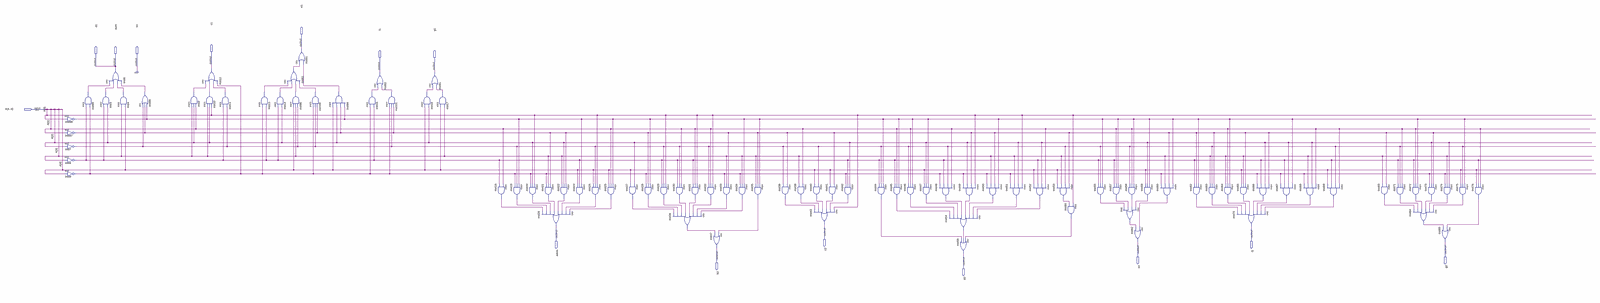
[diagram p0: schematic sheet, whole]
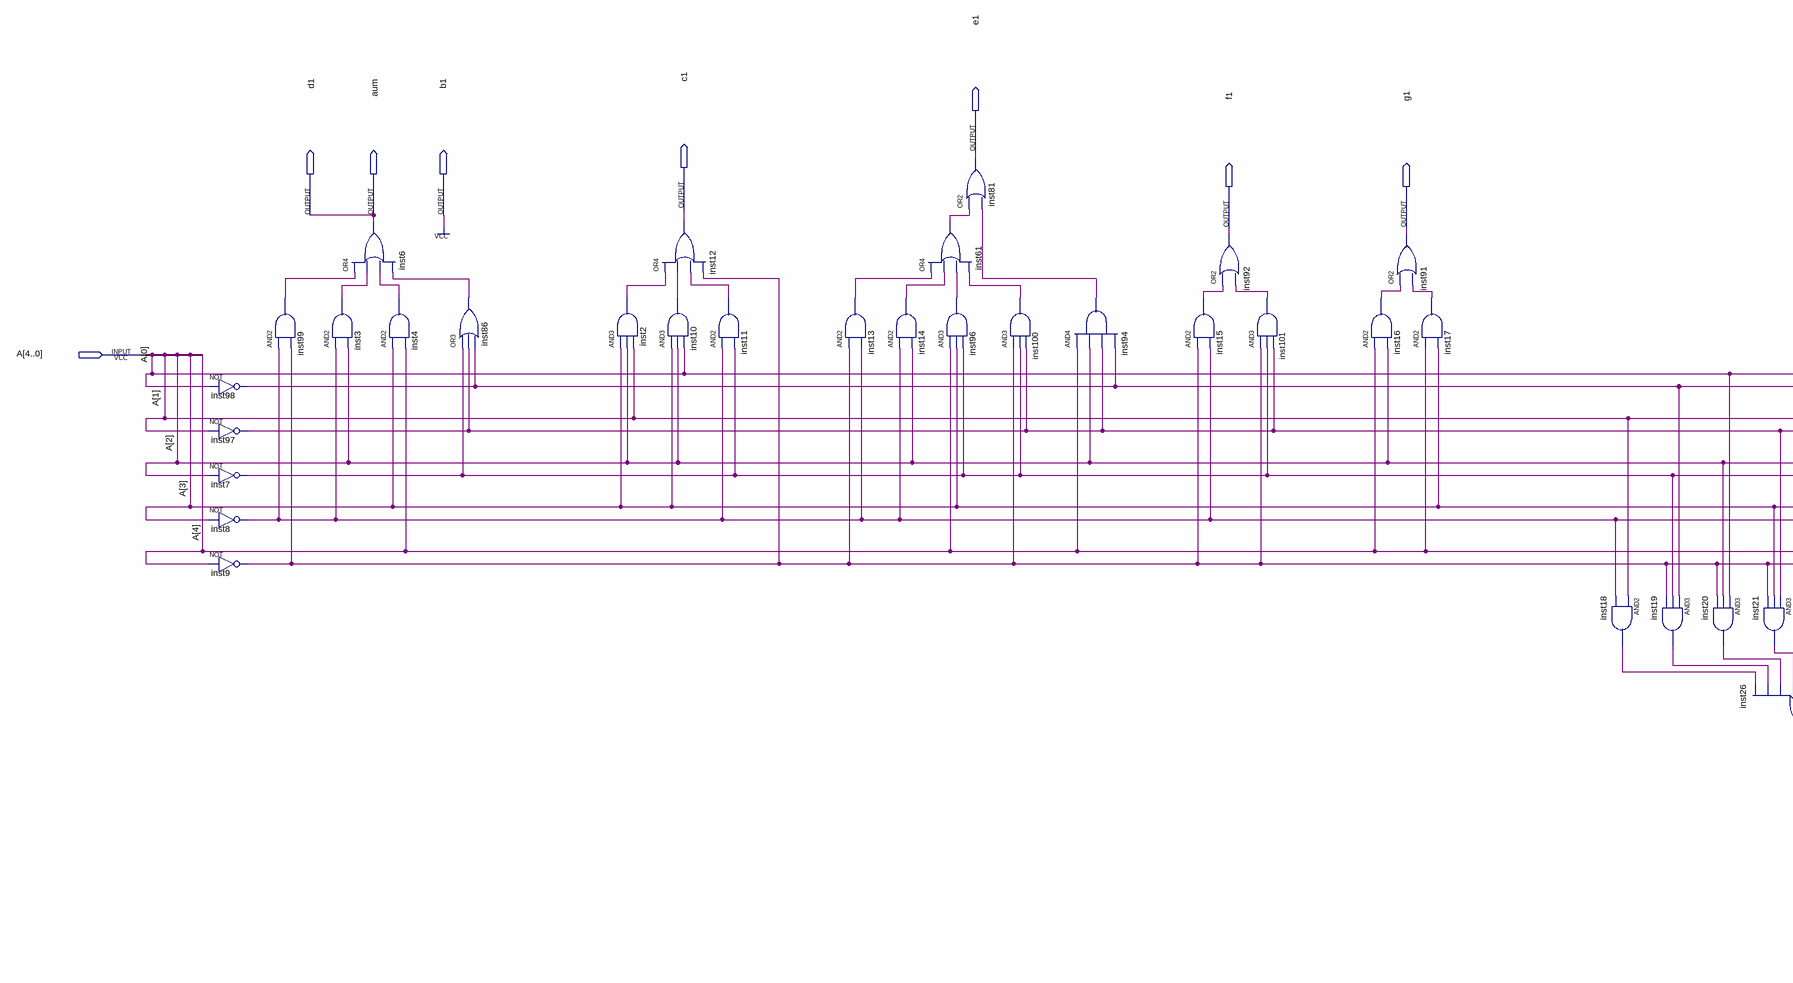
[diagram p1: schematic sheet, left part]
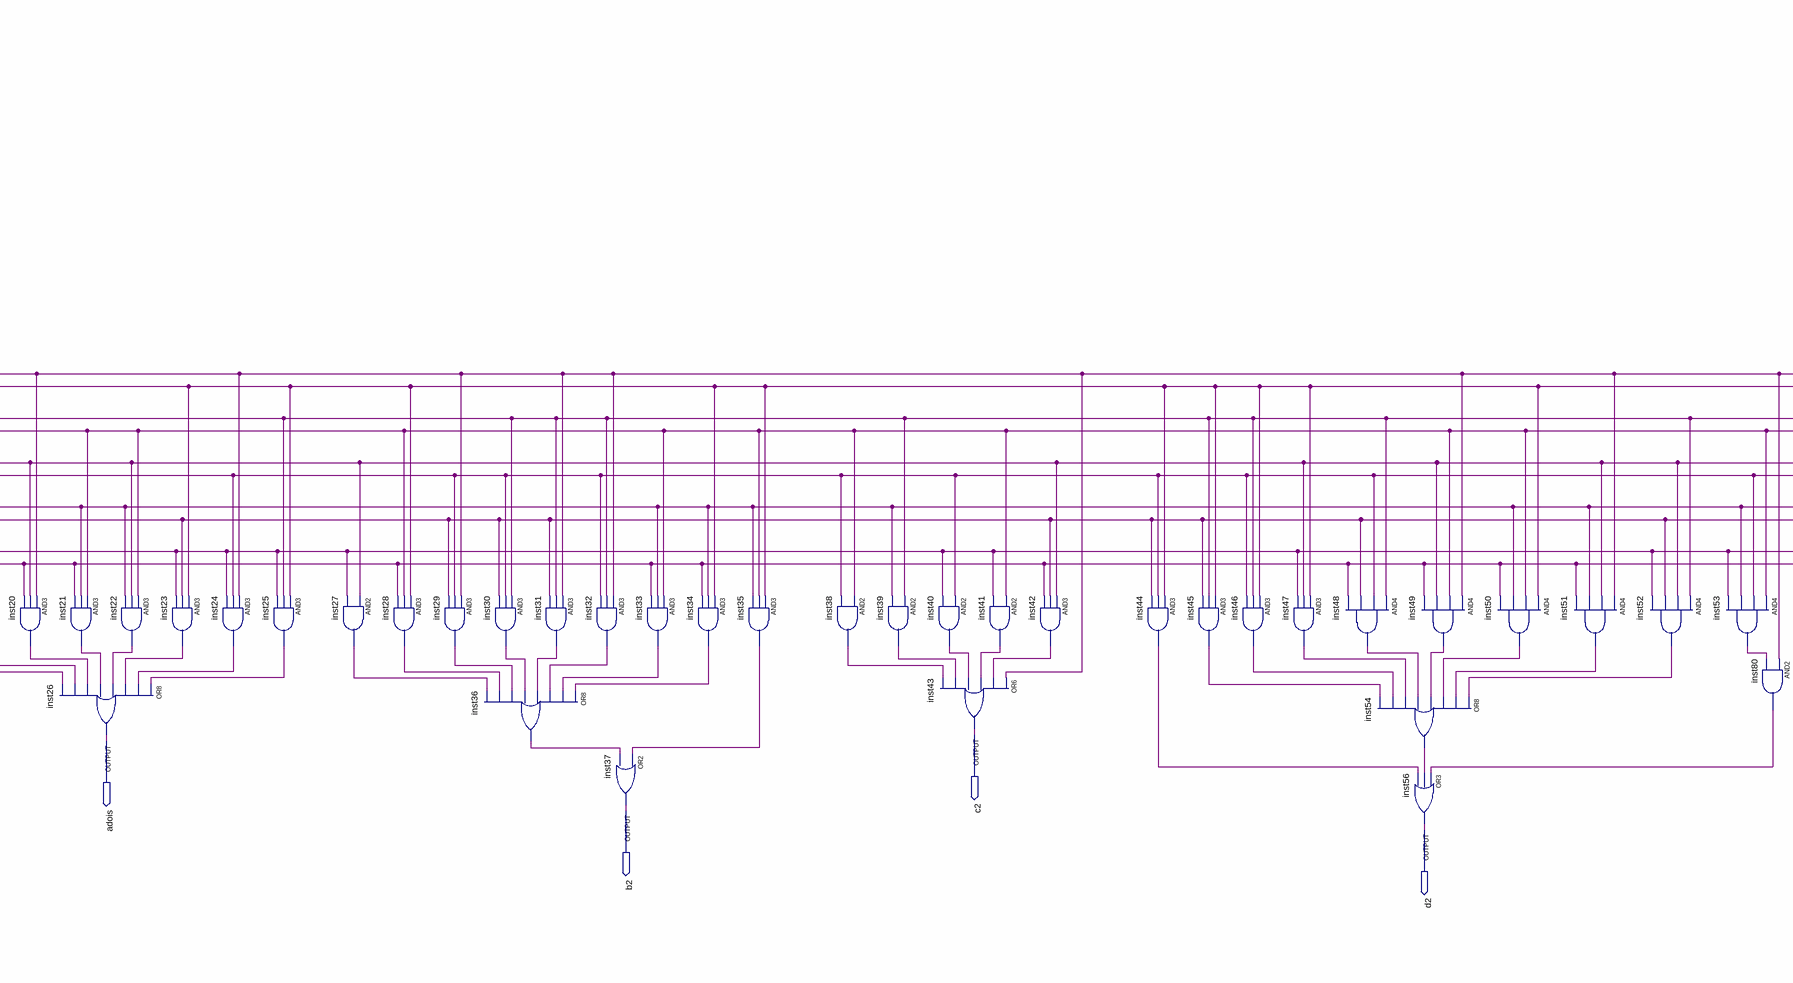
[diagram p2: schematic sheet, centre part]
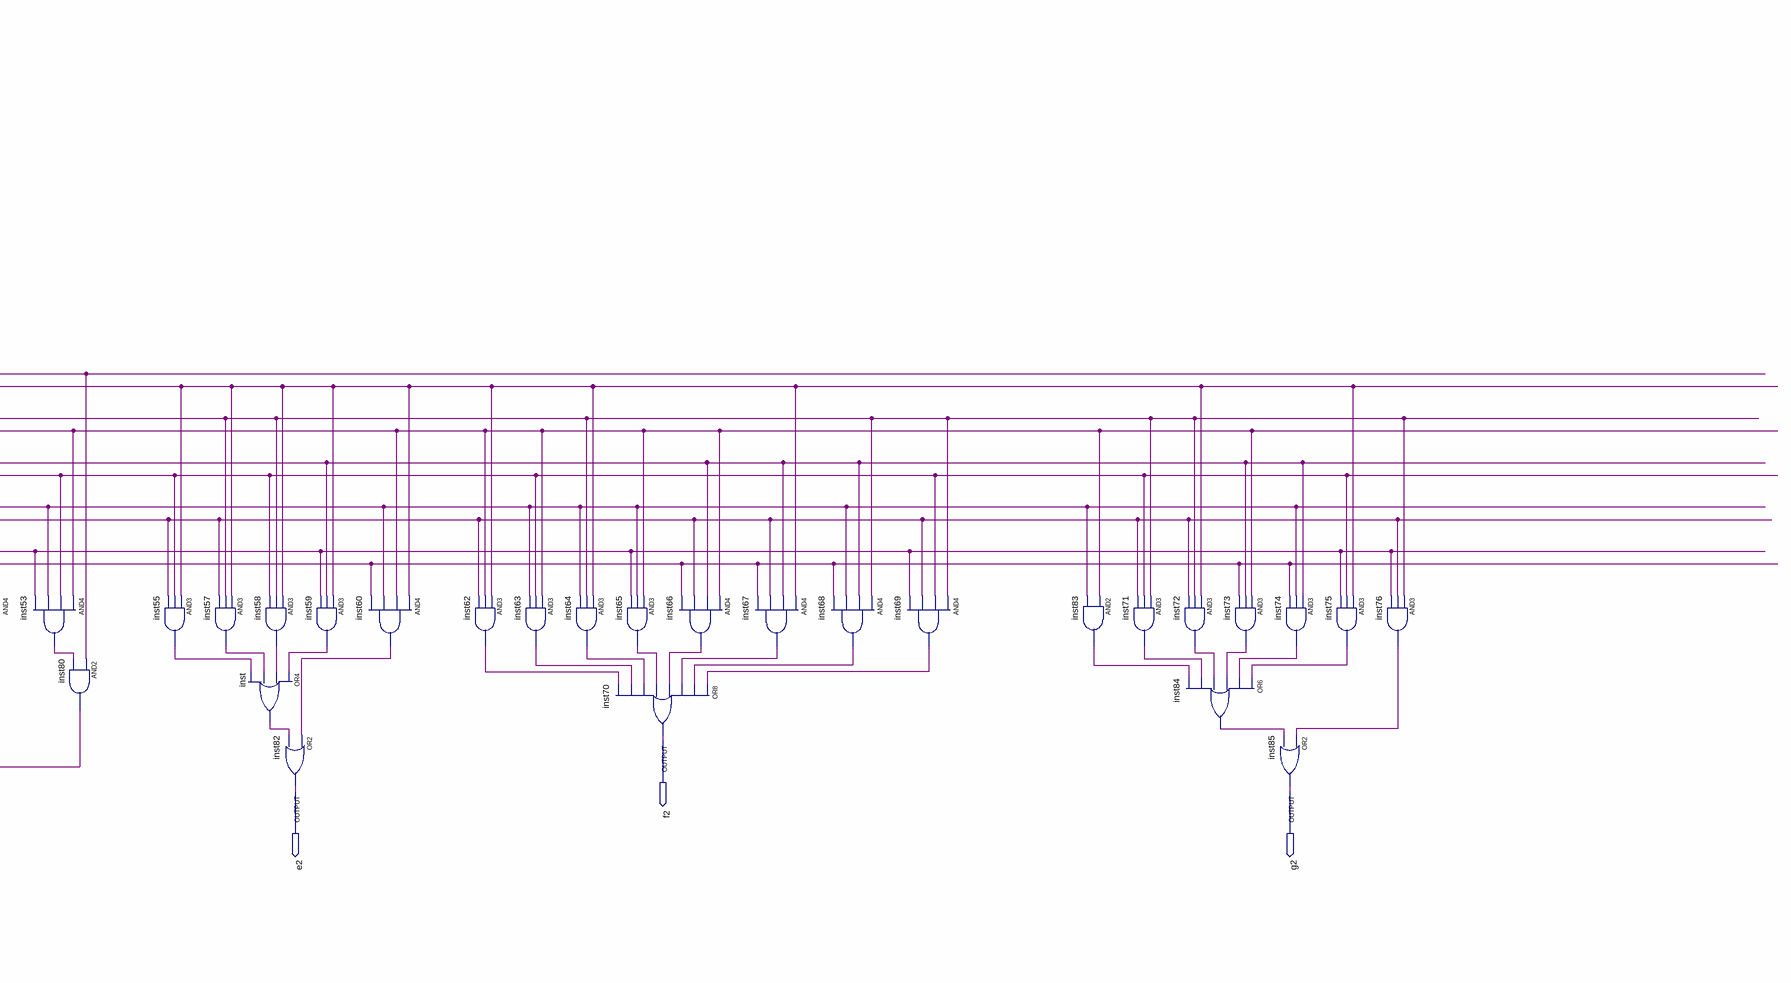
[diagram p3: schematic sheet, right part]
// Quartus schematic 7segmentos_saida.bdf as structural Verilog: 91 symbols, 15 pins
module \7segmentos_saida  (
  input  [4:0] A,
  output e1,
  output c1,
  output d1,
  output aum,
  output b1,
  output f1,
  output g1,
  output c2,
  output adois,
  output f2,
  output e2,
  output g2,
  output b2,
  output d2
);

  wire inst2_out, inst3_out, inst4_out, inst7_out, inst8_out, inst9_out, inst10_out, inst11_out, inst13_out,
       inst14_out, inst15_out, inst16_out, inst17_out, inst18_out, inst19_out, inst20_out, inst21_out,
       inst22_out, inst23_out, inst24_out, inst25_out, inst27_out, inst28_out, inst29_out, inst30_out,
       inst31_out, inst32_out, inst33_out, inst34_out, inst35_out, inst36_out, inst38_out, inst39_out,
       inst40_out, inst41_out, inst42_out, inst44_out, inst45_out, inst46_out, inst47_out, inst48_out,
       inst49_out, inst50_out, inst51_out, inst52_out, inst53_out, inst54_out, inst55_out, inst57_out,
       inst58_out, inst59_out, inst60_out, inst61_out, inst62_out, inst63_out, inst64_out, inst65_out,
       inst66_out, inst67_out, inst68_out, inst69_out, inst71_out, inst72_out, inst73_out, inst74_out,
       inst75_out, inst76_out, inst80_out, inst83_out, inst84_out, inst86_out, inst94_out, inst96_out,
       inst97_out, inst98_out, inst99_out, inst100_out, inst101_out, inst_out;

  not inst98 (inst98_out, A[0]);
  not inst97 (inst97_out, A[1]);
  not inst7 (inst7_out, A[2]);
  not inst8 (inst8_out, A[3]);
  not inst9 (inst9_out, A[4]);
  and inst99 (inst99_out, inst8_out, inst9_out);
  or inst6 (aum, inst99_out, inst3_out, inst4_out, inst86_out);
  and inst3 (inst3_out, inst8_out, A[2]);
  and inst4 (inst4_out, A[3], A[4]);
  or inst86 (inst86_out, inst7_out, inst97_out, inst98_out);
  or inst12 (c1, inst2_out, inst10_out, inst11_out, inst9_out);
  and inst2 (inst2_out, A[3], A[2], A[1]);
  and inst10 (inst10_out, A[3], A[2], A[0]);
  and inst11 (inst11_out, inst8_out, inst7_out);
  and inst13 (inst13_out, inst9_out, inst8_out);
  and inst14 (inst14_out, inst8_out, A[2]);
  or inst81 (e1, inst61_out, inst94_out);
  or inst61 (inst61_out, inst13_out, inst14_out, inst96_out, inst100_out);
  and inst96 (inst96_out, A[4], A[3], inst7_out);
  and inst100 (inst100_out, inst9_out, inst7_out, inst97_out);
  and inst94 (inst94_out, A[4], A[2], inst97_out, inst98_out);
  or inst92 (f1, inst15_out, inst101_out);
  and inst15 (inst15_out, inst9_out, inst8_out);
  and inst101 (inst101_out, inst9_out, inst7_out, inst97_out);
  and inst16 (inst16_out, A[4], A[2]);
  or inst91 (g1, inst16_out, inst17_out);
  and inst17 (inst17_out, A[4], A[3]);
  and inst18 (inst18_out, A[1], inst8_out);
  and inst19 (inst19_out, inst98_out, inst7_out, inst9_out);
  and inst20 (inst20_out, A[0], A[2], inst9_out);
  and inst21 (inst21_out, inst97_out, A[3], inst9_out);
  or inst26 (adois, inst25_out, inst24_out, inst23_out, inst22_out, inst21_out, inst20_out, inst19_out, inst18_out);
  and inst22 (inst22_out, inst97_out, A[2], A[3]);
  and inst23 (inst23_out, inst98_out, inst8_out, A[4]);
  and inst24 (inst24_out, A[0], inst7_out, A[4]);
  and inst25 (inst25_out, inst98_out, A[1], A[4]);
  and inst27 (inst27_out, A[2], A[4]);
  and inst28 (inst28_out, inst98_out, inst97_out, inst9_out);
  and inst29 (inst29_out, A[0], inst7_out, inst8_out);
  or inst36 (inst36_out, inst34_out, inst33_out, inst32_out, inst31_out, inst30_out, inst29_out, inst28_out, inst27_out);
  and inst30 (inst30_out, A[1], inst7_out, inst8_out);
  and inst31 (inst31_out, A[0], A[1], inst8_out);
  and inst32 (inst32_out, A[0], A[1], inst7_out);
  or inst37 (b2, inst35_out, inst36_out);
  and inst33 (inst33_out, inst97_out, A[3], inst9_out);
  and inst34 (inst34_out, inst98_out, A[3], inst9_out);
  and inst35 (inst35_out, inst98_out, inst97_out, A[3]);
  and inst38 (inst38_out, inst97_out, inst7_out);
  and inst39 (inst39_out, A[1], A[3]);
  and inst40 (inst40_out, inst7_out, A[4]);
  or inst43 (c2, A[0], inst42_out, inst41_out, inst40_out, inst39_out, inst38_out);
  and inst41 (inst41_out, inst97_out, A[4]);
  and inst42 (inst42_out, A[2], inst8_out, inst9_out);
  and inst44 (inst44_out, inst98_out, inst7_out, inst8_out);
  and inst45 (inst45_out, inst98_out, A[1], inst8_out);
  and inst46 (inst46_out, inst98_out, A[1], inst7_out);
  and inst47 (inst47_out, inst98_out, A[2], A[4]);
  and inst48 (inst48_out, A[1], inst7_out, inst8_out, inst9_out);
  or inst54 (inst54_out, inst52_out, inst51_out, inst50_out, inst49_out, inst48_out, inst47_out, inst46_out, inst45_out);
  and inst49 (inst49_out, A[0], inst97_out, A[2], inst9_out);
  or inst56 (d2, inst80_out, inst54_out, inst44_out);
  and inst50 (inst50_out, inst98_out, inst97_out, A[3], inst9_out);
  and inst51 (inst51_out, A[0], A[2], A[3], inst9_out);
  and inst52 (inst52_out, A[1], A[2], inst8_out, A[4]);
  and inst53 (inst53_out, inst97_out, inst7_out, A[3], A[4]);
  and inst80 (inst80_out, A[0], inst53_out);
  and inst55 (inst55_out, inst98_out, inst7_out, inst8_out);
  and inst57 (inst57_out, inst98_out, A[1], inst8_out);
  and inst58 (inst58_out, inst98_out, A[1], inst7_out);
  or inst (inst_out, inst59_out, inst58_out, inst57_out, inst55_out);
  and inst59 (inst59_out, inst98_out, A[2], A[4]);
  or inst82 (e2, inst60_out, inst_out);
  and inst60 (inst60_out, inst98_out, inst97_out, A[3], inst9_out);
  and inst62 (inst62_out, inst98_out, inst97_out, inst8_out);
  and inst63 (inst63_out, inst97_out, inst7_out, A[3]);
  and inst64 (inst64_out, inst98_out, A[1], A[3]);
  or inst70 (f2, inst69_out, inst68_out, inst67_out, inst66_out, inst65_out, inst64_out, inst63_out, inst62_out);
  and inst65 (inst65_out, inst97_out, A[3], A[4]);
  and inst66 (inst66_out, inst97_out, A[2], inst8_out, inst9_out);
  and inst67 (inst67_out, inst98_out, A[2], inst8_out, inst9_out);
  and inst68 (inst68_out, A[1], A[2], A[3], inst9_out);
  and inst69 (inst69_out, A[1], inst7_out, inst8_out, A[4]);
  and inst83 (inst83_out, inst97_out, A[3]);
  and inst71 (inst71_out, A[1], inst7_out, inst8_out);
  and inst72 (inst72_out, inst98_out, A[1], inst8_out);
  or inst84 (inst84_out, inst75_out, inst74_out, inst73_out, inst72_out, inst71_out, inst83_out);
  and inst73 (inst73_out, inst97_out, A[2], inst9_out);
  or inst85 (g2, inst76_out, inst84_out);
  and inst74 (inst74_out, A[2], A[3], inst9_out);
  and inst75 (inst75_out, inst98_out, inst7_out, A[4]);
  and inst76 (inst76_out, A[1], inst8_out, A[4]);

  assign b1 = 1'b1;
  assign d1 = aum;
endmodule
